# EAGLE design PiTlnfo-V1.2 (EAGLE 7.3.0)
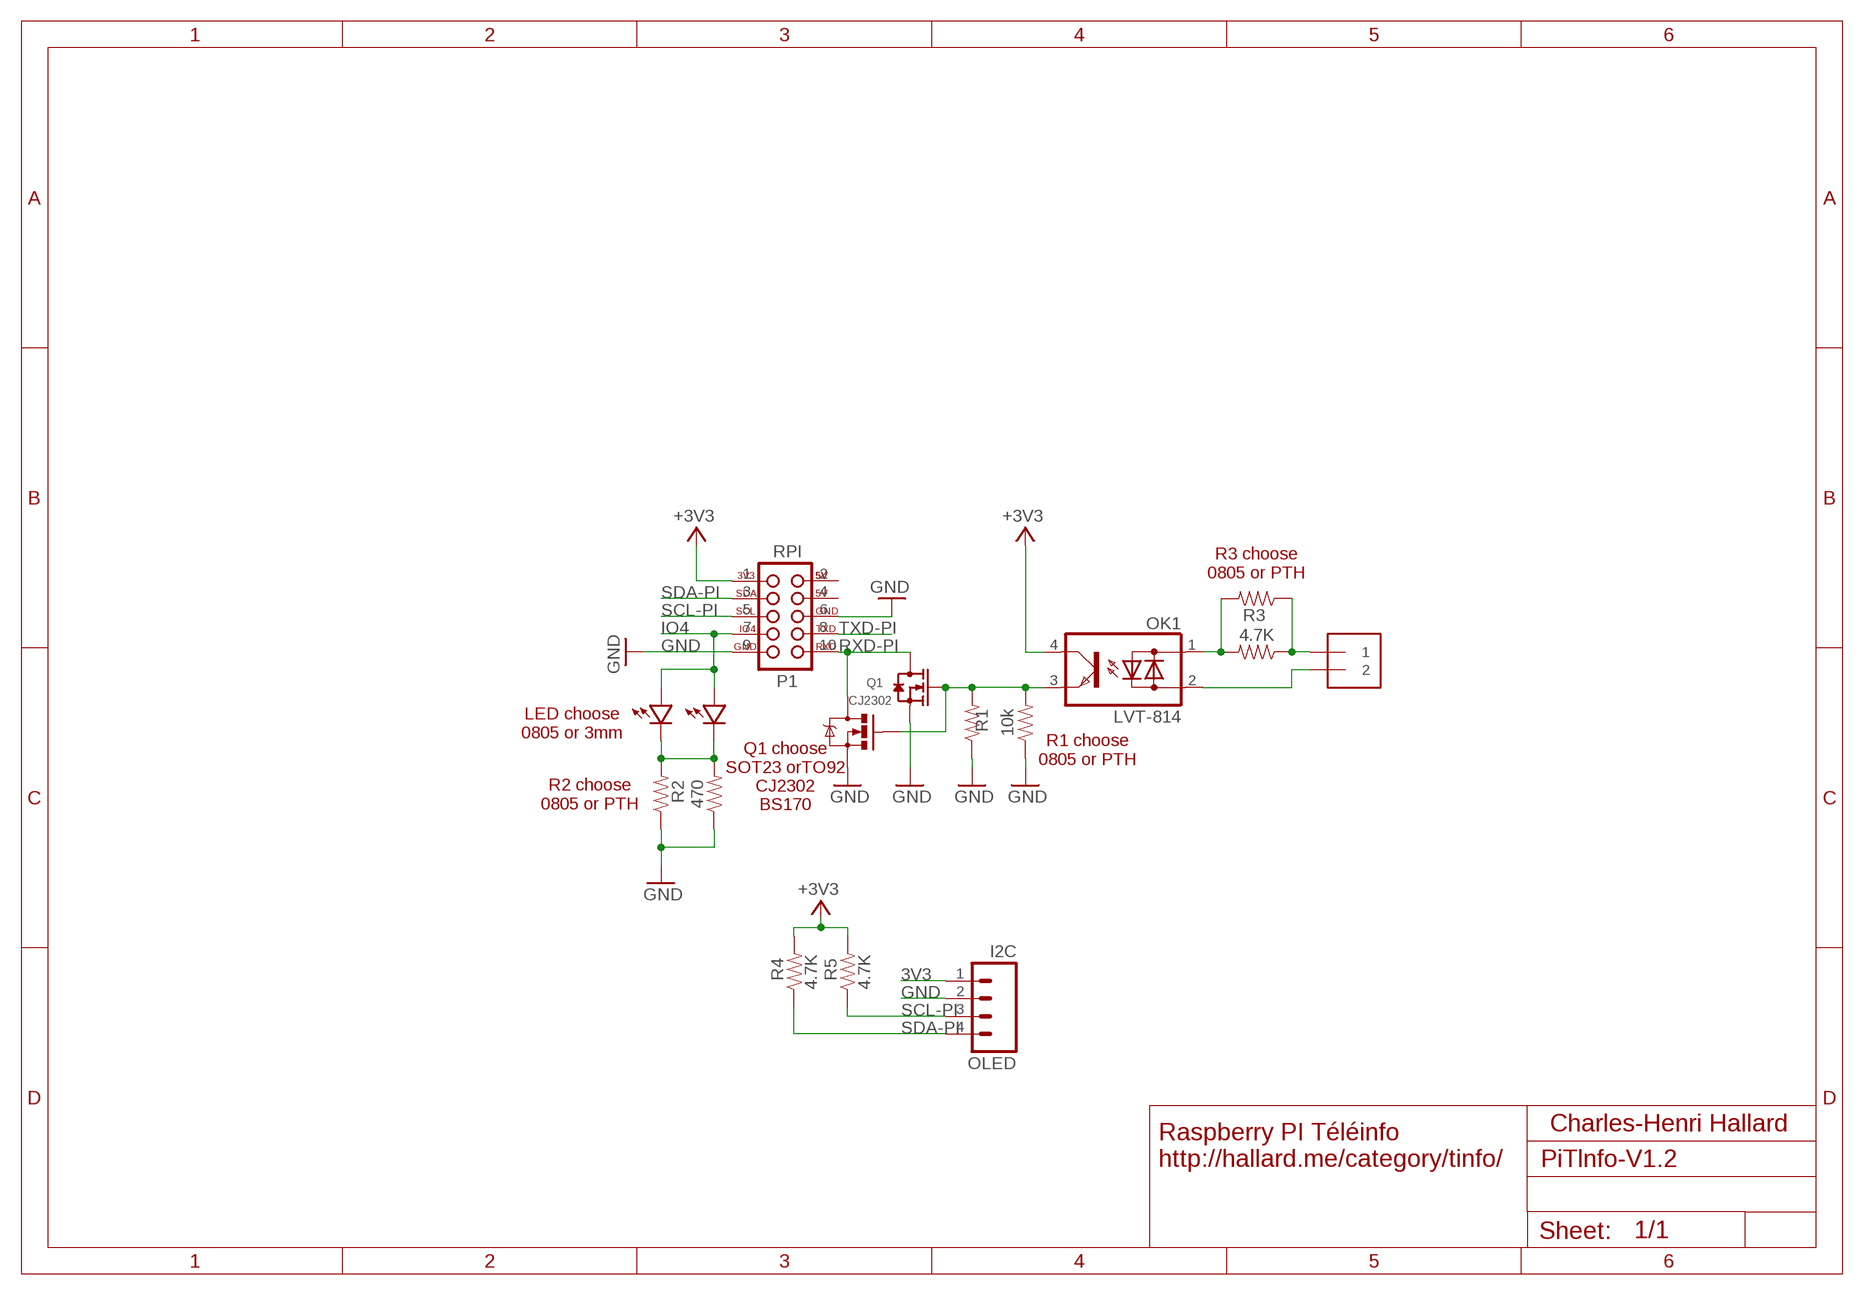
[diagram p0: schematic, sheet 1]

## Parts
J1  1X2-3.5MM  [1X2-3.5MM]
LED  LED0805-LARGE  [0805-LED-LARGEPADS]
LED3  LED3MM  [LED3MM]
OK1  LVT-814  SFH620A  [DIL04]
OLED  I2C  M04LOCK  [1X04_LOCK]
Q1  CJ2302  MOSFET-N-''  [SOT23]
Q2  MOS-N  MOSFET-NCHANNELBS170  [TO-92]
R1  10k  RESISTOR'1206-RES''  [1206-RES]
R2  470  RESISTORKIT  [AXIAL-0.3-KIT]
R3  4.7K  RESISTORKIT  [AXIAL-0.3-KIT]
R4  4.7K  RESISTOR0805-RES  [0805-RES]
R5  4.7K  RESISTOR0805-RES  [0805-RES]
R101  10K  RESISTORKIT  [AXIAL-0.3-KIT]
R102  470  RESISTOR'1206-RES''  [1206-RES]
R103  4.7K  RESISTOR'1206-RES''  [1206-RES]
U$2  RASPBERRY_PI_2X5  [2X05_LOCK]

## Nets
3V3 [power]: OK1.4(C) OLED.1 R4.2 R5.2 U$2.1 ; supply symbol labelled +3V3
GND [power]: OLED.2 Q1.2(S) Q2.3(S) R1.1 R2.P$1 R101.P$1 R102.1 U$2.6 U$2.9
IO4: LED3.PLUS LED.PLUS U$2.7
N$1: OK1.3(E) Q1.1(G) Q2.2(G) R1.2 R101.P$2
N$3: LED3.MINUS LED.MINUS R2.P$2 R102.2
N$5: J1.2 OK1.2(AC2)
N$6: J1.1 R3.P$1 R103.1
N$7: OK1.1(AC1) R3.P$2 R103.2
RXD-PI: Q1.3(D) Q2.1(D) U$2.10
SCL-PI: OLED.3 R5.1 U$2.5
SDA-PI: OLED.4 R4.1 U$2.3
TXD-PI: U$2.8

## Notes on the sheet
- R3 choose
  0805 or PTH
- LED choose
  0805 or 3mm
- R1 choose
  0805 or PTH
- Q1 choose
  SOT23 orTO92
  CJ2302
  BS170
- R2 choose
  0805 or PTH
- Charles-Henri Hallard
- Raspberry PI Téléinfo
  http://hallard.me/category/tinfo/

## Power pins joined to a net without a drawn wire
2: U$2.2
4: U$2.4

## Library data of the parts
J1 = adafruit:1X2: 3.5mm Terminal block http://www.ladyada.net/library/pcb/eaglelibrary.html
LED LED3 = _c2h:LED
OK1 = optocoupler:SFH620: Optocoupler, Phototransistor Output, AC Input Source: http://www.vishay.com/docs/83675/sfh620.pdf; MPN: SFH620A-2; OC_FARNELL: 1469594; OC_NEWARK: 97K9546
OLED = SparkFun-Connectors:M04: Header 4 Standard 4-pin 0.1" header. Use with straight break away headers (SKU : PRT-00116), right angle break away headers (PRT-00553), swiss pins (PRT-00743), machine pins (PRT-00117), and female headers (PRT-00115). Molex polarized connector foot print use with SKU : PRT-08231 with associated crimp pins and housings. 1MM SMD Version SKU: PRT-10208
Q1 = Seeed-Discrete:MOSFET-N: CJ2302：SMD MOSFET N-CH 20V-2.1A
Q2 = SparkFun-DiscreteSemi:MOSFET-NCHANNEL: Common NMOSFET Parts MFG P/N Store ID Prod ID FDD8780 TRANS-09984 SI7820DN TRANS-11055 FDS6630A IC-08089 2N7002PW TRANS-11151 FQP30N06L COM-10213 TRANS-10060 BSS123LT1G TRANS-08345 BSS138 TRANS-00830 BS170 2N7000
R1-R5 R101-R103 = _c2h:RESISTOR: Resistor Basic schematic elements and footprints for 0603, 1206, and PTH resistors.
U$2 = _c2h:RASPBERRY_PI_2X5

## Net classes
0 default: width 0.152 mm, drill 0.356 mm, clearance 0.152 mm
1 power: width 0.203 mm, drill 0.356 mm, clearance 0.152 mm

## Board
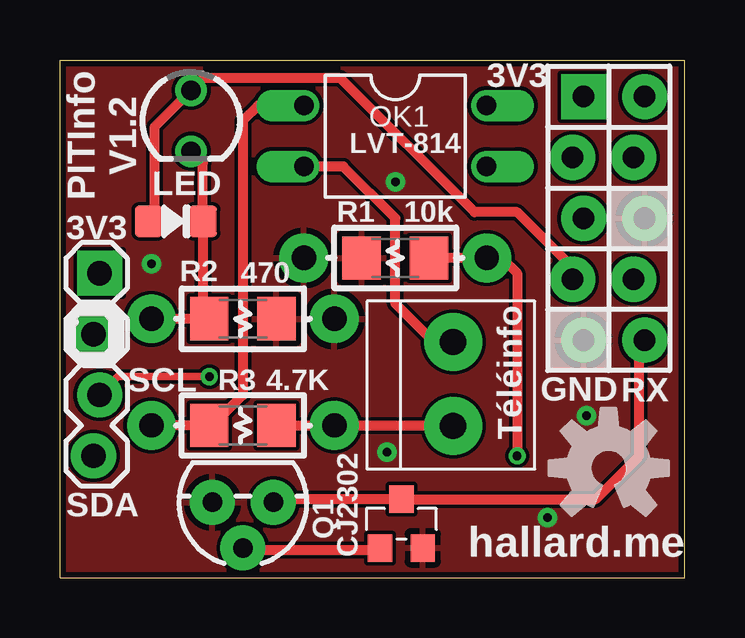
[diagram p1: board, top side]
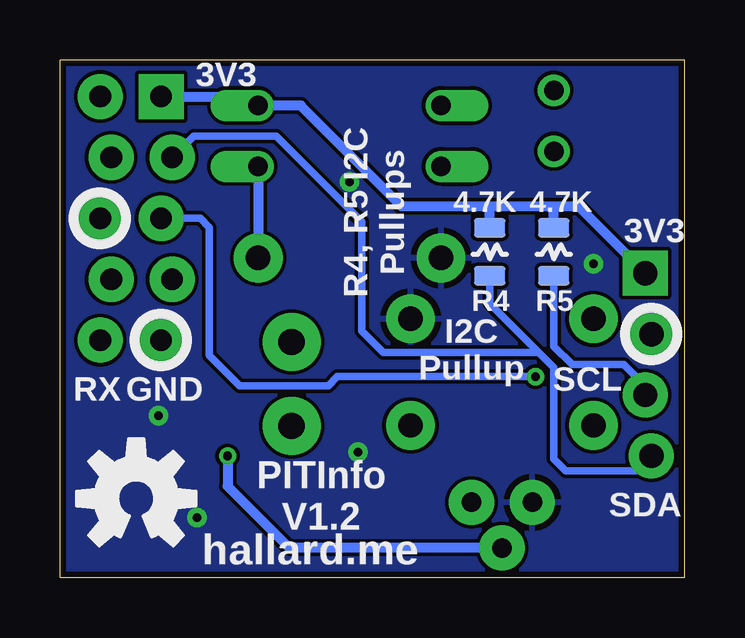
[diagram p2: board, bottom side, seen from below]

Size 26.04 x 21.59 mm. Coordinates in mm from the lower left corner, seen from the top.
Outline: 0,0 0,21.59 26.04,21.59 26.04,0 0,0
Copper layers (1*16): Top 0.035mm / dielectric 1.5mm / Bottom 0.035mm
Design rules "SeeedStudio_2layer_DRU_no_angle_20140221": minimum track width 6mil, minimum drill 12mil, track to track 6mil, track to pad 6mil, pad to pad 6mil, via to via 6mil, smd to smd 0mil, copper to edge 10mil, drill to drill 10mil, minimum pad ring 10mil, minimum via ring 6mil, stop-mask expansion 2mil, vias tented up to drill 100mil, thermal gap 10mil

### Footprints (pad centres in the part's own frame; a part is rotated, then mirrored left to right if it is on the bottom)
1X2-3.5MM = drill 1.1 pad 2.413: 1 1.8,0; 2 -1.7,0
0805-LED-LARGEPADS = smd 1.156 x 1.3: MINUS -1.127,0; PLUS 1.127,0
LED3MM = drill 0.813: MINUS 1.27,0; PLUS -1.27,0
DIL04 = drill 0.813 offset: 1 -1.27,-3.81; 2 1.27,-3.81; 3 1.27,3.81; 4 -1.27,3.81
1X04_LOCK = drill 1.016 pad 1.88 square: 1 0,0.127 | drill 1.016 pad 1.88: 2 2.54,-0.127; 3 5.08,0.127; 4 7.62,-0.127
SOT23 = smd 1.016 x 1.143: 1 -0.889,-1.016; 2 0.889,-1.016; 3 0,1.016
TO-92 = drill 0.813 pad 1.88: 1 -1.27,0; 2 0,1.905; 3 1.27,0
1206-RES = smd 1.6 x 1.8: 1 -1.4,0; 2 1.4,0
AXIAL-0.3-KIT = drill 1.016 pad 2.032: P$1 -3.81,0; P$2 3.81,0
0805-RES = smd 0.8 x 1.3: 1 -1,0; 2 1,0
2X05_LOCK = drill 0.9 pad 1.88 square: 1 -5.08,-1.041 | drill 0.9 pad 1.88: 2 -5.08,1.499; 3 -2.54,-1.499; 4 -2.54,1.041; 5 0,-1.041; 6 0,1.499; 7 2.54,-1.499; 8 2.54,1.041; 9 5.08,-1.041; 10 5.08,1.499

### Placement (x,y rotation side)
J1  16.38,8.13 270 top
LED  4.83,14.86 180 top
LED3  5.46,19.05 270 top
OK1  13.97,18.41 270 top
OLED  1.52,12.7 270 top
Q1  14.22,2.25 0 top
Q2  7.62,3.14 180 top
R1  13.97,13.34 0 top
R2  7.62,10.79 180 top
R3  7.62,6.35 180 top
R4  8.13,13.59 90 bottom
R5  5.46,13.59 90 bottom
R101  13.97,13.34 0 top
R102  7.62,10.79 180 top
R103  7.62,6.35 180 top
U$1  [OSHW-LOGO-M]  22.86,3.3 0 bottom
U$2  22.86,14.99 270 top
U$4  [OSHW-LOGO-M]  22.86,4.57 0 top

### Tracks (layer width: path | path; a pad name or v marks a point on that pad's centre or on a via)
3V3
  Bottom 0.406: 8.13,15.49 11.81,15.49 16,19.68 OK1.4 18.16,20.07 U$2.1 | 8.13,15.49 5.59,15.49 | 5.59,15.49 4.45,15.49 OLED.1 | R5.2 5.46,15.37 5.59,15.49 | R4.2 8.13,15.49
GND  (via drill 0.36 pad 0.81)
  other vias: 13.97,16.51 21.94,6.76 3.81,13.08 13.62,5.24 20.32,2.51
  pour Bottom: -2.54,23.88 27.94,24 27.94,-2.79 -2.54,-2.79
  pour Top: -1.27,-1.52 26.67,-1.52 26.67,22.73 -1.27,22.61
IO4
  Top 0.406: LED.PLUS 3.95,15.35 3.95,18.81 LED3.PLUS 5.97,20.83 11.68,20.83 17.27,15.24 19.05,15.24 21.36,12.93 U$2.7
N$1  (via drill 0.36 pad 0.71)
  Top 0.406: R1.2 R101.P$2 18.41,13.34 19.05,12.7 v19.05,5.08 | Q1.1 13.24,1.14 7.71,1.14 Q2.2
  Bottom 0.406: v19.05,5.08 19.05,3.81 16.51,1.27 7.65,1.27 Q2.2 | OK1.3 R101.P$2
N$3
  Top 0.406: R2.P$2 R102.2 5.95,11.06 LED.MINUS 5.95,17.29 LED3.MINUS
N$5
  Top 0.406: OK1.2 11.81,17.14 13.97,14.99 13.97,11.43 15.49,9.91 16.38,9.91 J1.2
N$6
  Top 0.406: R103.1 R3.P$1 16.36,6.35 J1.1
N$7
  Top 0.406: OK1.1 8.26,19.68 7.62,19.05 7.62,7.62 6.35,6.35 R103.2 R3.P$2
RXD-PI
  Top 0.406: U$2.10 24.13,9.68 24.13,5.08 22.32,3.27 Q1.3 9.11,3.27 Q2.1
SCL-PI  (via drill 0.36 pad 0.71)
  Top 0.305: v6.22,8.38 2.41,8.38 OLED.3
  Bottom 0.305: 21.82,14.96 U$2.5 20.19,14.99 19.81,14.61 19.81,9.27 18.54,8 14.86,8 14.48,8.38 v6.22,8.38 | R5.1 5.46,9.65 4.7,8.89 2.54,8.89 1.65,8 OLED.3
SDA-PI
  Bottom 0.305: 6.1,9.4 8.13,11.43 R4.1 | 6.1,9.4 5.46,8.76 5.46,4.95 4.95,4.45 2.03,4.45 OLED.4 | 6.1,9.4 12.57,9.4 13.46,10.29 13.46,14.86 17.02,18.41 20.47,18.41 U$2.3

### Text on the board
tNames: 3V3 | PITInfo / V1.2 | 3V3 | Téléinfo | SCL | GND | RX | SDA | hallard.me
bNames: 3V3 | 3V3 | R4, R5 I2C / Pullups | I2C / Pullup | SCL | GND | RX | SDA | PITInfo / V1.2 | hallard.me